# Altium schematic sheet Control.SchDoc
size A; SheetNumber: 1; SheetTotal: 1
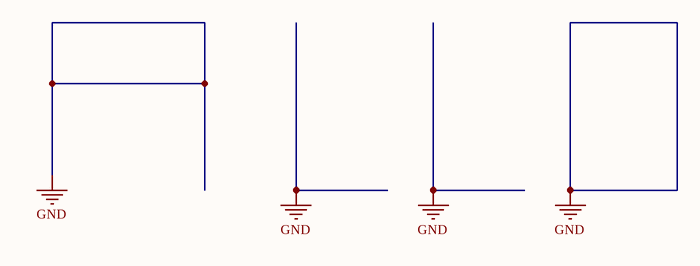
[diagram p0: Control.SchDoc]